# EasyEDA schematic Schematic_Radio_EasyEDA.json
TITLE: Projeto Final de Eletrônica Geral 1; REV: 1.0; Date: 2025-02-25; Sheet: 1/1; Company: UTFPR
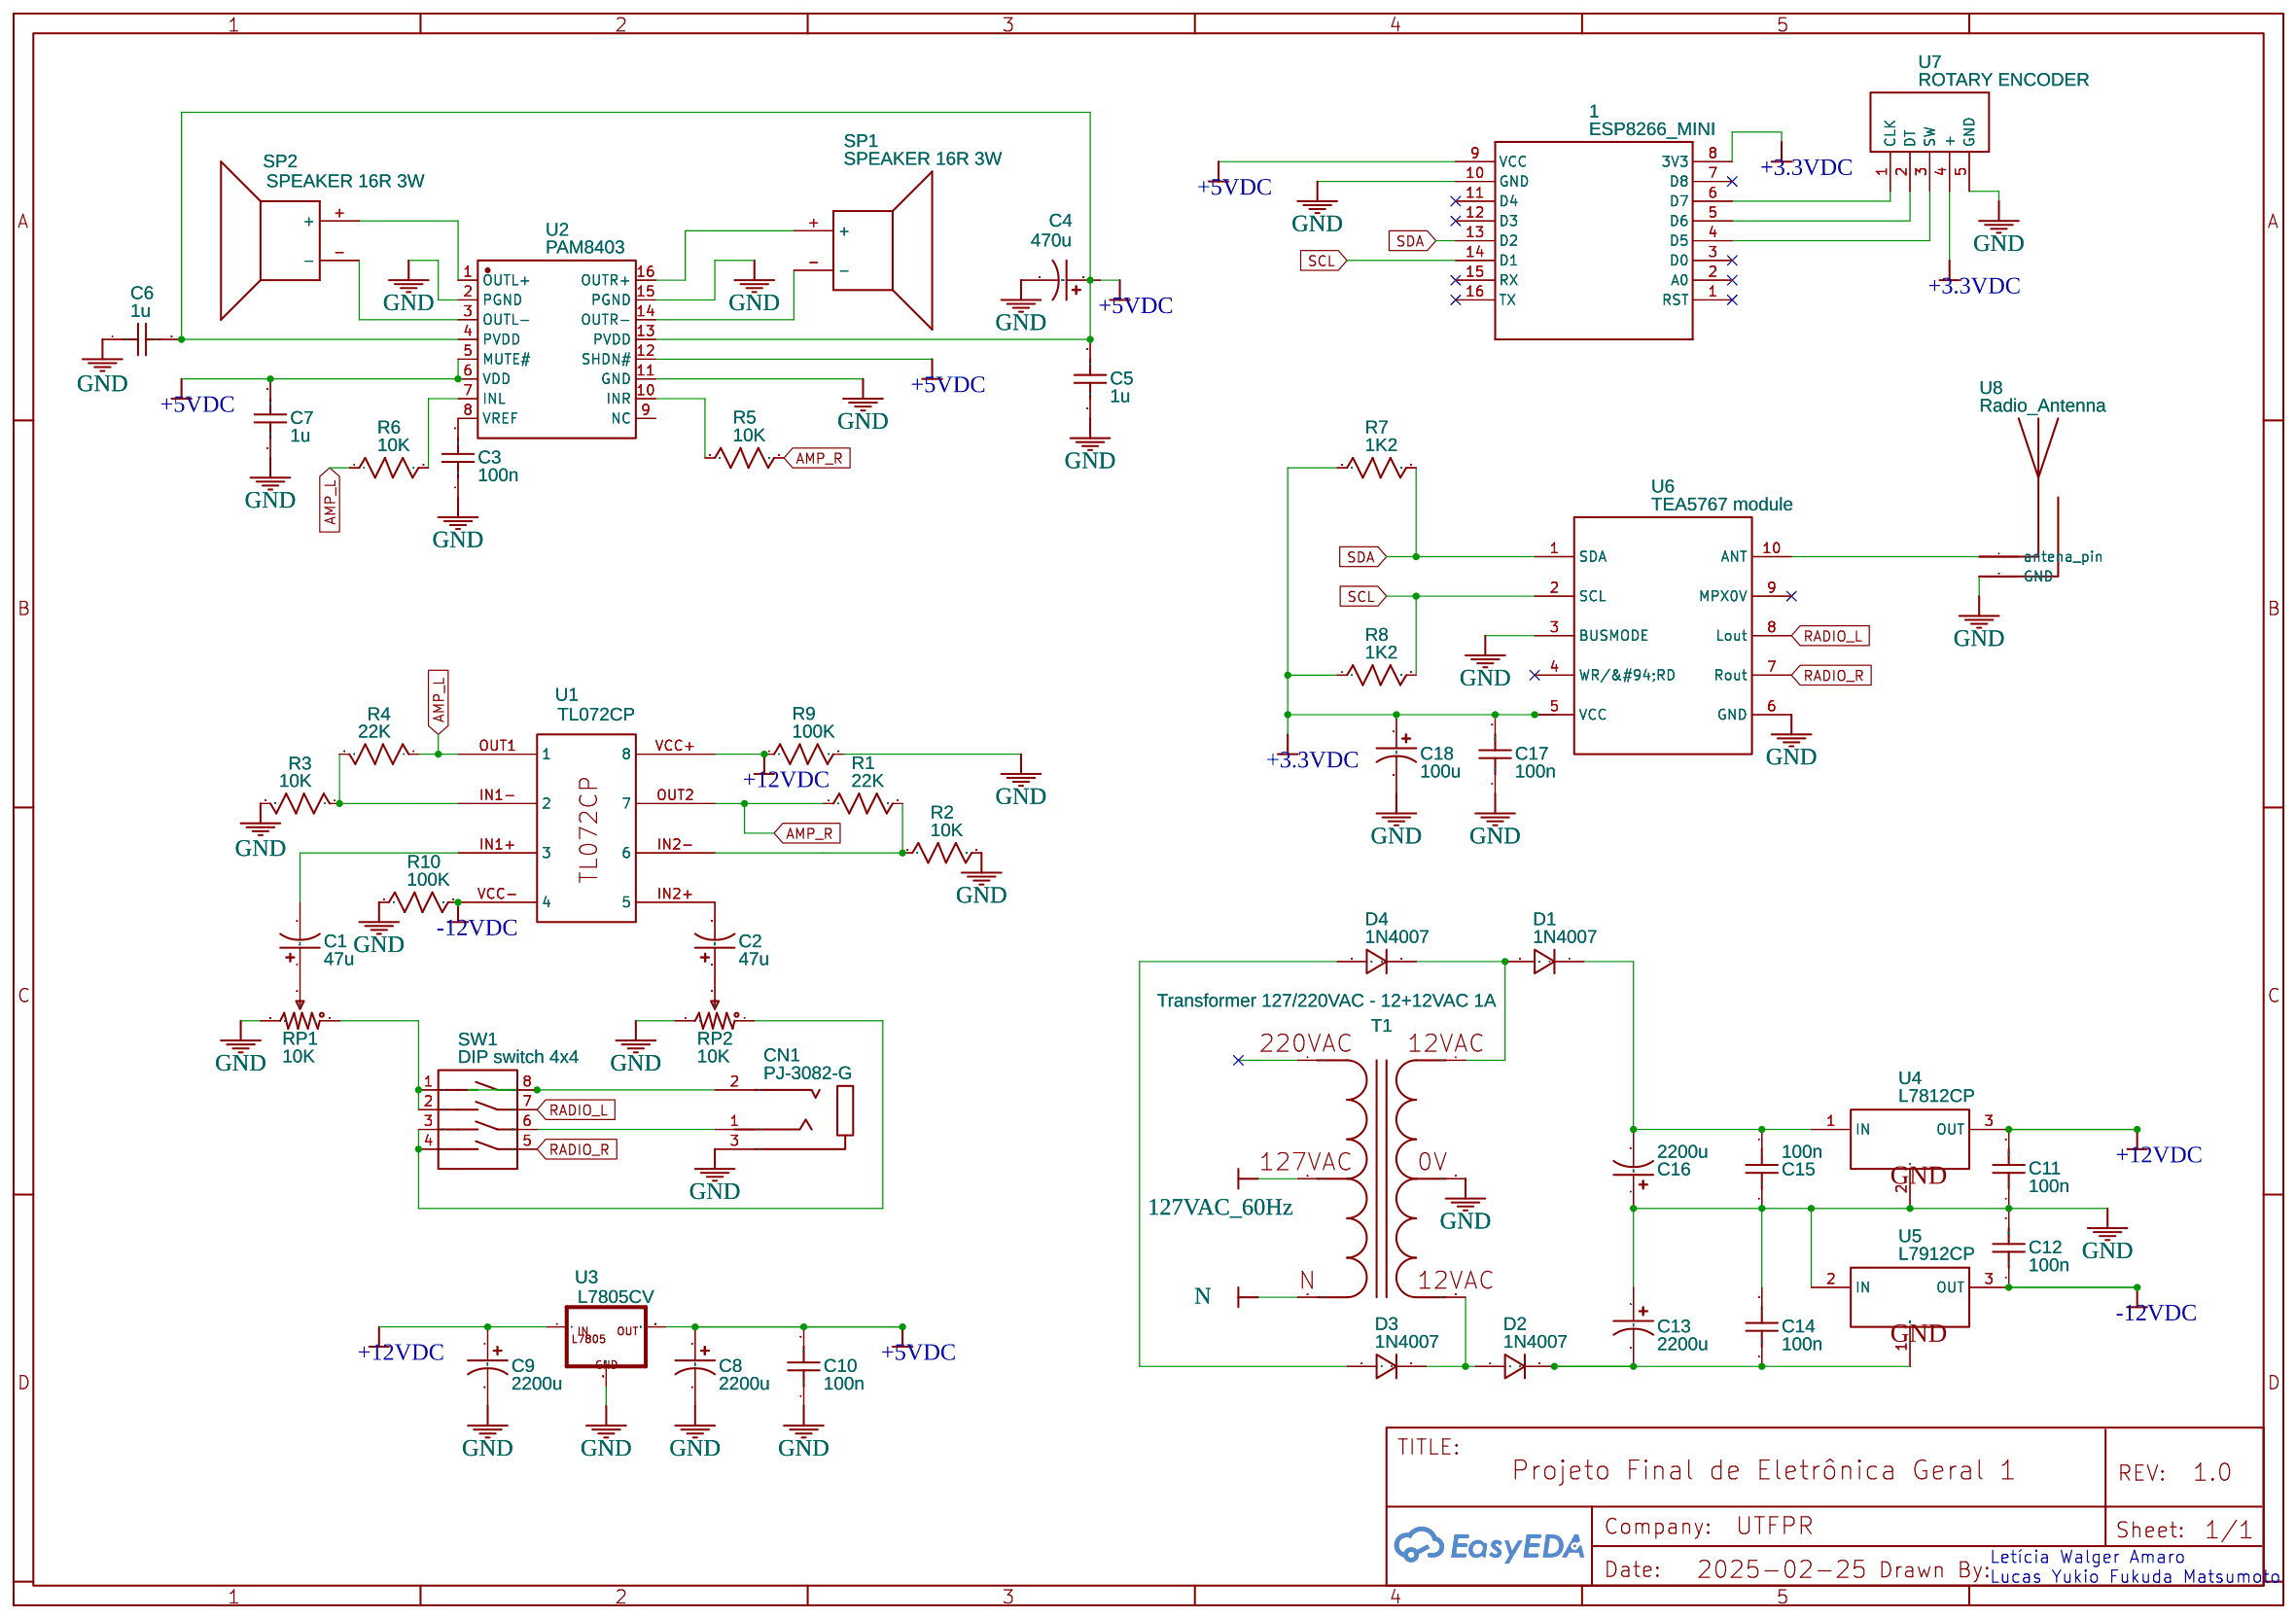
[diagram p0: schematic sheet]

## Parts
1  ESP8266_MINI  [ESP8266MINI]
C1  47u  [CASE-A_3216]
C2  47u  [CASE-A_3216]
C3  100n  [C0603]
C4  470u  [CASE-A_3216]
C5  1u  [C0603]
C6  1u  [C0603]
C7  1u  [C0603]
C8  2200u  [CASE-A_3216]
C9  2200u  [CASE-A_3216]
C10  100n  [C0603]
C11  100n  [C0603]
C12  100n  [C0603]
C13  2200u  [CASE-A_3216]
C14  100n  [C0603]
C15  100n  [C0603]
C16  2200u  [CASE-A_3216]
C17  100n  [C0603]
C18  100u  [CASE-A_3216]
CN1  PJ-3082-G  [AUDIO-TH_XKB_PJ-3733]
D1  1N4007  [SOD-123_L2.8-W1.8-LS3.7-RD]
D2  1N4007  [SOD-123_L2.8-W1.8-LS3.7-RD]
D3  1N4007  [SOD-123_L2.8-W1.8-LS3.7-RD]
D4  1N4007  [SOD-123_L2.8-W1.8-LS3.7-RD]
R1  22K  [R0603]
R2  10K  [R0603]
R3  10K  [R0603]
R4  22K  [R0603]
R5  10K  [R0603]
R6  10K  [R0603]
R7  1K2  [R0603]
R8  1K2  [R0603]
R9  100K  [R0603]
R10  100K  [R0603]
RP1  10K  [RES-ADJ-TH_3386P]
RP2  10K  [RES-ADJ-TH_3386P]
SP1  SPEAKER 16R 3W  [PCB_MOUNT_SPEAKER]
SP2  SPEAKER 16R 3W  [PCB_MOUNT_SPEAKER]
SW1  DIP switch 4x4  [SW-TH_DIPSWITCHEI-04]
T1  Transformer 127/220VAC - 12+12VAC 1A  [TRANSFORMER]
U1  TL072CP  [DIP-8_L9.6-W6.4-P2.54-LS7.6-BL-1]
U2  PAM8403  [SOP-16_L10.0-W3.9-P1.27-LS6.0-BL]
U3  L7805CV  [L7805]
U4  L7812CP  [TO220FP]
U5  L7912CP  [TO-220FP]
U6  TEA5767 module  [TEA5767]
U7  ROTARY ENCODER  [ROTARYENCODER]
U8  Radio_Antenna  [RADIO_ANTENNA]

## Library data of the parts
1 = ESP8266MINI COPY: Contributor: kevinbrice
C1 C2 C4 C8 C9 C13 C16 C18 = C_Tan_SMD_A_US: Contributor: LCEDA_Lib
C3 C5-C7 C10-C12 C14 C15 C17 = C_0603_US: Contributor: LCEDA_Lib
CN1 = PJ-3733: Contributor: LCSC; Supplier: LCSC; Supplier Part: C2884966; Manufacturer: XKB Connection(中国星坤); JLCPCB Part Class: Extended Part
D1-D4 = 1N4007W: Supplier: LCSC; Supplier Part: C328592; Manufacturer: BLUE ROCKET; Contributor: LCEDA_Lib
R1-R10 = R_0603_US: Contributor: LCEDA_Lib
RP1 = R_3386P_US: Supplier: LCSC; Contributor: LCEDA_Lib; Package Display: No
RP2 = R_3386P_US: Supplier: LCSC; Contributor: LCEDA_Lib
SP1 SP2 = SPEAKER: Contributor: SparkFun
SW1 = DIP switchEI-04: Supplier: LCSC; Manufacturer: 圜达; Manufacturer Part: 拨码开关EI-04; Supplier Part: C99987; JLCPCB Part Class: Extended Part
T1 = Transformer: RATIO: 1; Supplier Part: 0876-4441D_20141119133342; Supplier: Toroidy; Contributor: iluks; Manufacturer Part: TTG-6C33CPP; Manufacturer: Toroidy; link: https://sklep.toroidy.pl/en_US/p/TTG-6C33CPP-Tube-output-transformer-1%2C2kOhm-2x6C33C-Push-pull-or-similar/565
U1 = TL072CP: tags: FET Operational Amplifier; subpart_no: 2; Supplier Part: C7236; Supplier: LCSC; Manufacturer: TI(德州仪器); JLCPCB Part Class: Extended Part; Contributor: iluks
U2 = PAM8403: Contributor: lcsc; Supplier: LCSC; Supplier Part: C5122557; Manufacturer: Slkor(萨科微); JLCPCB Part Class: Extended Part
U3 = -L7805
U4 = L7812CP: Positive Voltage Regulator, 12V, 3-Pin TO-220FP
U5 = L7912CP: Negative Voltage Regulator, -12V, 3-Pin TO-220FP
U6 = TEA5767 module: Contributor: demon81
U7 = ROTARY ENCODER (BREAKOUT): Contributor: aditya_sabnis
U8 = Radio_Antenna: Contributor: donial

## Nets
127VAC_60Hz: T1.2
+3.3VDC: 1.8(3V3) C17.2 C18.1 R7.1 R8.1 U6.5(VCC) U7.4(+)
+5VDC: 1.9(VCC) C4.1 C7.2 C8.1 C10.2 U2.5(MUTE#) U2.6(VDD) U2.12(SHDN#) U3.OUT
+12VDC: C9.1 C11.2 R9.1 U1.VCC+(8) U3.IN U4.3(OUT)
-12VDC: C12.1 R10.2 U1.VCC-(4) U5.3(OUT)
GND: 1.10(GND) C3.1 C4.2 C5.1 C6.1 C7.1 C8.2 C9.2 C10.1 C11.1 C12.2 C13.1 C14.2 C15.2 C16.1 C17.1 C18.2 CN1.3 R2.2 R3.2 R9.2 R10.1 RP1.3 RP2.3 T1.5 U2.2(PGND) U2.11(GND) U2.15(PGND) U3.GND U4.2(GND) U5.2(IN) U6.3(BUSMODE) U6.6(GND) U7.5(GND) U8.2(GND)
AMP_L: R4.1 R6.1 U1.OUT1(1)
AMP_R: R1.1 R5.2 U1.OUT2(7)
N: T1.3
RADIO_L: SW1.7 U6.8(Lout)
RADIO_R: SW1.5 U6.7(Rout)
SCL: 1.14(D1) R8.2 U6.2(SCL)
SDA: 1.13(D2) R7.2 U6.1(SDA)
Net-(1-4): 1.4(D5) U7.3(SW)
Net-(1-5): 1.5(D6) U7.2(DT)
Net-(1-6): 1.6(D7) U7.1(CLK)
Net-(C1-1): C1.1 RP1.2
Net-(C1-2): C1.2 U1.IN1+(3)
Net-(C2-1): C2.1 RP2.2
Net-(C2-2): C2.2 U1.IN2+(5)
Net-(C3-2): C3.2 U2.8(VREF)
Net-(C5-2): C5.2 C6.2 U2.4(PVDD) U2.13(PVDD)
Net-(C13-2): C13.2 C14.1 D2.1 U5.1(GND)
Net-(C15-1): C15.1 C16.2 D1.1 U4.1(IN)
Net-(CN1-1): CN1.1 SW1.6
Net-(CN1-2): CN1.2 SW1.8
Net-(D1-2): D1.2 D4.1 T1.4
Net-(D2-2): D2.2 D3.1 T1.6
Net-(D3-2): D3.2 D4.2
Net-(R1-2): R1.2 R2.1 U1.IN2-(6)
Net-(R3-1): R3.1 R4.2 U1.IN1-(2)
Net-(R5-1): R5.1 U2.10(INR)
Net-(R6-2): R6.2 U2.7(INL)
Net-(RP1-1): RP1.1 SW1.1 SW1.2
Net-(RP2-1): RP2.1 SW1.3 SW1.4
Net-(SP1-+): SP1.+ U2.16(OUTR+)
Net-(SP1--): SP1.- U2.14(OUTR-)
Net-(SP2-+): SP2.+ U2.1(OUTL+)
Net-(SP2--): SP2.- U2.3(OUTL-)
Net-(U6-10): U6.10(ANT) U8.1(antena_pin)

Not connected (* = marked no-connect by the designer): 1 1(RST)* 2(A0)* 3(D0)* 7(D8)* 11(D4)* 12(D3)* 15(RX)* 16(TX)*; T1 1; U2 9(NC); U6 4(WR/&#94;RD)* 9(MPX0V)*

## Notes on the sheet
- Letícia Walger Amaro
- Lucas Yukio Fukuda Matsumoto
